# EAGLE board Cing_MainBoard (EAGLE 9.4.0), part 1 of 2
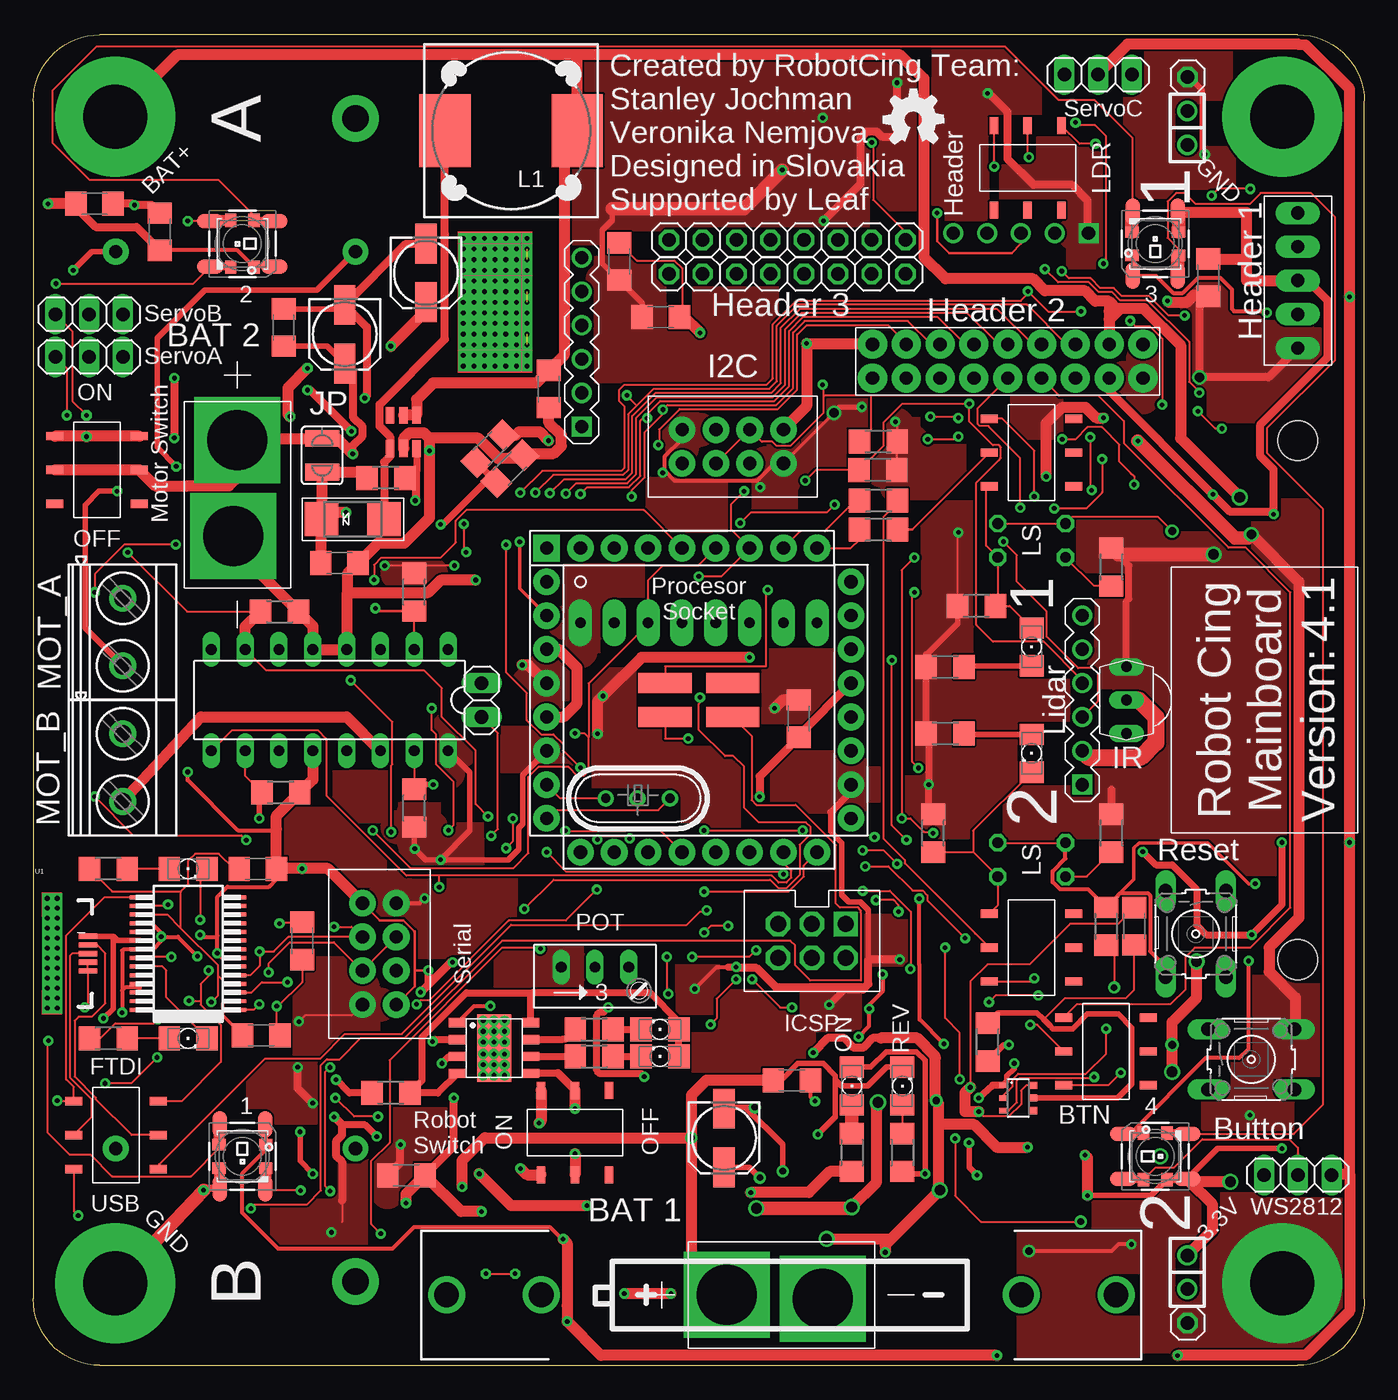
[diagram p7: board, top side]
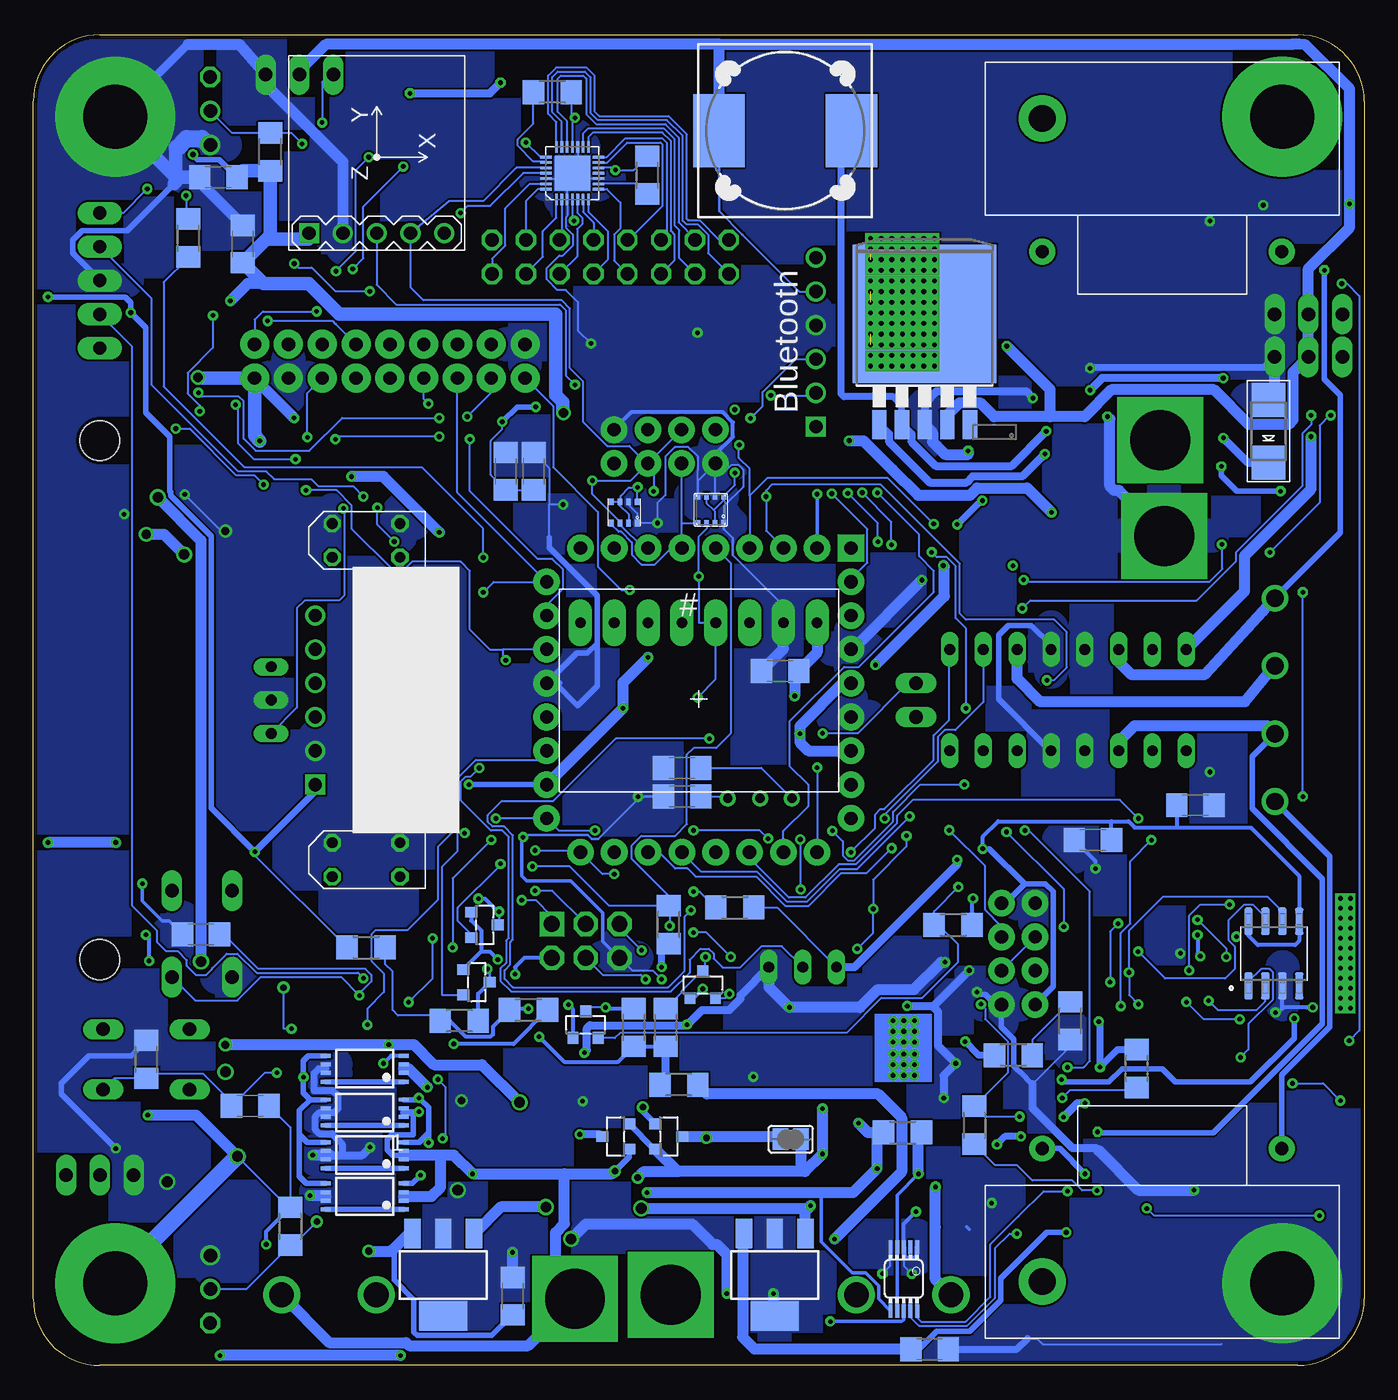
[diagram p8: board, bottom side, seen from below]

Size 100 x 100 mm. Coordinates in mm from the lower left corner, seen from the top.
Outline: 5,0 95,0 arc90 100,5 100,95 arc90 95,100 5,100 arc90 0,95 0,5 arc90 5,0
Copper layers (1*16): Top 0.035mm / dielectric 1.5mm / Bottom 0.035mm
Design rules "default *": minimum track width 6mil, minimum drill 0.35mm, track to track 6mil, track to pad 6mil, pad to pad 6mil, via to via 6mil, smd to smd 6mil, copper to edge 10mil, drill to drill 6mil, minimum pad ring 10mil, minimum via ring 8mil, stop-mask expansion 4mil, vias tented up to drill 0mil, thermal gap 10mil

## Footprints (pad centres in the part's own frame; a part is rotated, then mirrored left to right if it is on the bottom)
TSSOP-8 = smd 0.3 x 0.75: 1 -0.975,-2.925; 2 -0.325,-2.925; 3 0.325,-2.925; 4 0.975,-2.925; 5 0.975,2.925; 6 0.325,2.925; 7 -0.325,2.925; 8 -0.975,2.925
BATTERY-AA-KIT = drill 1.854: GND@1 25.146,0; GND@2 18.034,0; PWR@1 -25.146,0; PWR@2 -18.034,0
C1206 = smd 1.6 x 1.8: 1 -1.4,0; 2 1.4,0
153CLV-0505 = smd 3 x 1.6: + 2.2,0; - -2.2,0
SMADIODE = smd 2.54 x 2.54: A 2.349,0; C -2.349,0
L293 = drill 0.813 long: 1 -8.89,-3.81; 2 -6.35,-3.81; 3 -3.81,-3.81; 4 -1.27,-3.81; 5 1.27,-3.81; 6 3.81,-3.81; 7 6.35,-3.81; 8 8.89,-3.81; 9 8.89,3.81; 10 6.35,3.81; 11 3.81,3.81; 12 1.27,3.81; 13 -1.27,3.81; 14 -3.81,3.81; 15 -6.35,3.81; 16 -8.89,3.81
TO263-5 = smd 1.067 x 2.159: 1 -3.404,-5.791; 2 -1.702,-5.791; 3 0,-5.791; 4 1.702,-5.791; 5 3.404,-5.791 | smd 10.8 x 10.41: 6 0,2.54
FT232RL = smd 0.3 x 1.5: 1 -4.225,-3.625; 2 -3.575,-3.625; 3 -2.925,-3.625; 4 -2.275,-3.625; 5 -1.625,-3.625; 6 -0.975,-3.625; 7 -0.325,-3.625; 8 0.325,-3.625; 9 0.975,-3.625; 10 1.625,-3.625; 11 2.275,-3.625; 12 2.925,-3.625; 13 3.575,-3.625; 14 4.225,-3.625; 15 4.225,3.625; 16 3.575,3.625; 17 2.925,3.625; 18 2.275,3.625; 19 1.625,3.625; 20 0.975,3.625; 21 0.325,3.625; 22 -0.325,3.625; 23 -0.975,3.625; 24 -1.625,3.625; 25 -2.275,3.625; 26 -2.925,3.625; 27 -3.575,3.625; 28 -4.225,3.625
BMP280 = smd 0.35 x 0.5: 1 0.975,-0.8; 2 0.325,-0.8; 3 -0.325,-0.8; 4 -0.975,-0.8; 5 -0.975,0.8; 6 -0.325,0.8; 7 0.325,0.8; 8 0.975,0.8
BME280 = smd 0.35 x 0.5: 1 0.975,-1.025; 2 0.325,-1.025; 3 -0.325,-1.025; 4 -0.975,-1.025; 5 -0.975,1.025; 6 -0.325,1.025; 7 0.325,1.025; 8 0.975,1.025
1X01 = drill 1.016 octagon: 1 0,0
1X03 = drill 1.016 long: 1 -2.54,0; 2 0,0; 3 2.54,0
ICSP_HEADER = drill 1.2 pad 1.829 square: 1 -1.27,2.54 | drill 1.2 pad 1.829 octagon: 2 1.27,2.54; 3 -1.27,0; 4 1.27,0; 5 -1.27,-2.54; 6 1.27,-2.54
1X02 = drill 1.016 long: 1 -1.27,0; 2 1.27,0
DR125 = smd 3.85 x 5.5: 1 -4.975,0; 2 4.975,0
DR127 = smd 3.85 x 5.5: 1 -4.975,0; 2 4.975,0
1206 = smd 1.6 x 1.803: A -1.422,0; C 1.422,0
LED3535 = smd 1 x 0.85: 1 -1.75,0.875; 2 -1.75,-0.875; 3 1.75,-0.875; 4 1.75,0.875
WS2812B = smd 2 x 1.1: 1 -2.4,1.7; 2 -2.4,-1.7; 3 2.4,-1.7; 4 2.4,1.7
TCRT5000 = drill 0.8 octagon: A -2.54,1.27; C 2.54,1.27; E 2.54,-1.27; K -2.54,-1.27
MKDSN1,5/2-5,08 = drill 1.3 pad 2: 1 -2.561,0.025; 2 2.519,0.025
RJ9W = drill 0.813 long: A 2.54,0.635; E -2.54,0.635; S 0,0.635
HC49U = drill 0.7 pad 1.2: 1 -2.413,0; 2 -0.027,0; 3 2.413,0
SOT23 = smd 0.8 x 0.9: 1 -0.95,-1; 2 0.95,-1; 3 0,1
R1206 = smd 1.6 x 1.803: 1 -1.422,0; 2 1.422,0
LDR_OFFBOARD = drill 1.016: 1 -1.27,0; 2 1.27,0
B3F-10XX = drill 1.016 long: 1 -3.251,2.261; 2 3.251,2.261; 3 -3.251,-2.261; 4 3.251,-2.261
SJW = smd 1.27 x 2.54: 1 -1.27,0; 2 1.27,0
SJ = smd 1.168 x 1.6: 1 -0.762,0; 2 0.762,0
USB_SWITCH = smd 1.27 x 0.635: CH1A -3.175,2.54; CH1B -3.175,-2.54; CH2A 3.175,2.54; CH2B 3.175,-2.54; COM1 -3.175,0; COM2 3.175,0
TP4056 = smd 1.3 x 0.7: 1 -2.75,1.905; 2 -2.75,0.635; 3 -2.75,-0.635; 4 -2.75,-1.905; 5 2.75,-1.905; 6 2.75,-0.635; 7 2.75,0.635; 8 2.75,1.905 | smd 2.54 x 5.08: RADIATOR 0,0
TSOP18XX = drill 0.813 long: GND -0.001,-0.027; OUT -2.501,-0.027; VCC 2.499,-0.027
USB-MICRO-SMD = smd 1.4 x 0.4: D+1 2.7,0; D-1 2.7,0.65; GND1 2.7,-1.3; ID1 2.7,-0.65; VBUS1 2.7,1.3
QFN-28 = smd 0.85 x 0.2: 1 -1.975,1.2; 2 -1.975,0.8; 3 -1.975,0.4; 4 -1.975,0; 5 -1.975,-0.4; 6 -1.975,-0.8; 7 -1.975,-1.2; 15 1.975,-1.2; 16 1.975,-0.8; 17 1.975,-0.4; 18 1.975,0; 19 1.975,0.4; 20 1.975,0.8; 21 1.975,1.2 | smd 0.2 x 0.85: 8 -1.2,-1.975; 9 -0.8,-1.975; 10 -0.4,-1.975; 11 0,-1.975; 12 0.4,-1.975; 13 0.8,-1.975; 14 1.2,-1.975; 22 1.2,1.975; 23 0.8,1.975; 24 0.4,1.975; 25 0,1.975; 26 -0.4,1.975; 27 -0.8,1.975; 28 -1.2,1.975 | smd 2.65 x 2.65: 29 0,0
MPU-6050 = drill 0.8 pad 1.778 long: ADO 0,-6.35; GND 0,6.35; INT 0,-8.89; SCL 0,3.81; SDA 0,1.27; VCC 0,8.89; XCL 0,-3.81; XDA 0,-1.27
SOIC-8N = smd 0.65 x 2.07: 1 -1.905,-2.425; 2 -0.635,-2.425; 3 0.635,-2.425; 4 1.905,-2.425; 5 1.905,2.425; 6 0.635,2.425; 7 -0.635,2.425; 8 -1.905,2.425
PROCESSOR-SOCKET_PCB = smd 4 x 1.5: 32 2.54,1.27; 36 -2.54,1.27; D+ 2.54,-1.27; D- -2.54,-1.27 | drill 1 pad 2: A0 11.43,6.35; A1 11.43,8.89; A2 8.89,11.43; A3 6.35,11.43; A4 3.81,11.43; A5 1.27,11.43; A6 11.43,-3.81; A7 11.43,3.81; AREF 11.43,-1.27; CRYST1 -11.43,-6.35; CRYST2 -11.43,-8.89; D0 -3.81,11.43; D1 -6.35,11.43; D2 -8.89,11.43; D3 -11.43,8.89; D4 -11.43,6.35; D5 -8.89,-11.43; D6 -6.35,-11.43; D7 -3.81,-11.43; D8 -1.27,-11.43; D9 1.27,-11.43; D10 3.81,-11.43; D11 6.35,-11.43; D12 8.89,-11.43; D13 11.43,-8.89; GND -11.43,3.81; GND2 -11.43,-1.27; GND3 11.43,1.27; RESET -1.27,11.43; VCC -11.43,1.27; VCC2 -11.43,-3.81; VCC3 11.43,-6.35 | drill 1 pad 2 square: P$1 -11.43,11.43
BIG_HEADER = drill 1 pad 2.184: +3V3 1.27,10.16; +5V -1.27,7.62; +5V1 1.27,-10.16; A0 1.27,-7.62; A1 1.27,-5.08; A4 1.27,-2.54; A5 1.27,0; A6 1.27,2.54; A7 1.27,5.08; D0 -1.27,-7.62; D1 -1.27,-5.08; D2 -1.27,-2.54; D3 -1.27,0; D4 -1.27,2.54; D5 -1.27,5.08; D6 -1.27,10.16; GND -1.27,-10.16; GND2 1.27,7.62
I2_HEADER = drill 1 pad 2: 5V 1.27,3.81; +5V -1.27,-3.81; GND1 -1.27,3.81; GND2 1.27,-3.81; SCL 1.27,-1.27; SCL2 -1.27,1.27; SDA 1.27,1.27; SDA2 -1.27,-1.27
SERIAL_HEADER = drill 1 pad 2: 5V 1.27,3.81; +5V -1.27,-3.81; GND -1.27,3.81; GND2 1.27,-3.81; RXD -1.27,-1.27; RXD2 1.27,1.27; TXD -1.27,1.27; TXD2 1.27,-1.27
SOT23-6 = smd 1.27 x 0.635: P$1 0,0; P$2 0,-1; P$3 0,-2; P$4 2.5,-2; P$5 2.5,-1; P$6 2.5,0
BATTERY_CONECTOR_D = drill 4.5 pad 6.452 square: + 4.1,0; - -3.1,0.3
SOT23-6' = smd 0.4 x 0.55: 1 -0.95,-1.15; 2 0,-1.15; 3 0.95,-1.15 | smd 0.55 x 0.55: 4 0.95,1.15; 5 0,1.15; 6 -0.95,1.15
POLULU_MOTOR = drill 1 pad 1.93: + -10,9; - -10,-9 | drill 2 pad 3.5: P$1 0,9; P$2 0,-9
CONNECTOR_1X5 = drill 1 pad 1.676 long: +5V 0,-5.08; A1 0,5.08; A2 0,2.54; A3 0,-2.54; GND 0,0
MSOP10_0.5 = smd 0.3 x 1.02: 1 -1,-2.4; 2 -0.5,-2.4; 3 0,-2.4; 4 0.5,-2.4; 5 1,-2.4; 6 1,2.4; 7 0.5,2.4; 8 0,2.4; 9 -0.5,2.4; 10 -1,2.4
RANGING-SENSOR-VL53L0X = drill 1 square: 1 -3.81,6.35 | drill 1: 2 -3.81,3.81; 3 -3.81,1.27; 4 -3.81,-1.27; 5 -3.81,-3.81; 6 -3.81,-6.35
COMPASS-HMC5883L = drill 1 square: 1 -5.715,5.08 | drill 1: 2 -5.715,2.54; 3 -5.715,0; 4 -5.715,-2.54; 5 -5.715,-5.08
LEGO-1X1 = drill 4.8 pad 9: LEGO 0,0
BALL = hole 3: 0,19.5; 0,-19.5
WIRELESS-BLUETOOTH-HC-05 = drill 1 square: 1 -6.35,0 | drill 1: 2 -3.81,0; 3 -1.27,0; 4 1.27,0; 5 3.81,0; 6 6.35,0
LM39100S-3.3 = smd 1.219 x 2.235: 1 -2.311,-3.099; 2 0,-3.099; 3 2.311,-3.099 | smd 3.6 x 2.2: TAB 0,3.099

## Placement (x,y rotation side)
1  FS8205  [TSSOP-8]  75.1,19 90 bottom
8205  FS8205  [TSSOP-8]  75.1,15.8 90 bottom
BT1  [BATTERY-AA-KIT]  56.2,5.3 0 top
C1  100n  [C1206]  56.98,21.43 0 top
C2  100n  [C1206]  16.87,37.32 0 top
C3  100n  [C1206]  17.12,24.8 0 top
C4  22uf  [C1206]  4.6,87.3 0 top
C5  100n  [C1206]  84.26,84.28 90 bottom
C6  100n  [C1206]  86.1,89.3 0 bottom
C7  22p  [C1206]  51.26,44.9 0 bottom
C8  22p  [C1206]  51.26,42.74 0 bottom
C9  100n  [C1206]  9.5,85.2 90 top
C10  100n  [C1206]  32.66,1.21 0 bottom
C11  100n  [C1206]  63.98,5.21 270 bottom
C12  100n  [C1206]  28.02,14.28 0 top
C13  100n  [C1206]  88.27,81.75 90 top
C14  22uf  [C1206]  23,60.3 0 top
C15  22uf  [C1206]  38.74,73.37 270 top
C16  100n  [C1206]  82.7,33 90 top
C17  47uf  [153CLV-0505]  29.5,82.1 270 top
C18  100n  [C1206]  20.2,31.9 90 top
C19  100n  [C1206]  47.14,78.79 0 top
C20  100n  [C1206]  44.01,82.96 90 top
C21  100n  [C1206]  43.9,52.2 0 bottom
C22  22uf  [C1206]  57.5,48.6 270 top
C23  47uf  [153CLV-0505]  23.4,77.5 270 top
C24  100n  [C1206]  18.8,78 90 top
C25  100n  [C1206]  87.4,32.4 0 bottom
C26  100n  [C1206]  83.7,19.5 0 bottom
C27  10uf  [153CLV-0505]  51.9,17.1 270 top
C28  100n  [C1206]  12.7,42.1 0 bottom
C29  100n  [C1206]  20.4,39.5 0 bottom
C30  100n  [C1206]  62.4,67.2 270 bottom
C31  100n  [C1206]  64.5,67.2 270 bottom
D1  [SMADIODE]  7.2,70.2 90 bottom
D3  [SMADIODE]  24,63.6 0 top
IC1  L293D  [L293]  22.27,50 180 top
IC2  LM2576S  [TO263-5]  33.04,76.5 0 bottom
IC3  FT232RL  [FT232RL]  11.63,30.95 90 top
IC4  BMP280  [BMP280]  55.6,64.1 0 bottom
IC5  BME280  [BME280]  49.1,64.3 0 bottom
JP1  [1X01]  57.91,82.03 0 top
JP2  ServoA  [1X03]  4.2,75.8 0 top
JP3  ServoB  [1X03]  4.2,79 0 top
JP4  ServoC  [1X03]  80,97 0 top
JP5  ICSP  [ICSP_HEADER]  58.5,31.9 270 top
JP6  [1X01]  57.91,84.58 0 top
JP7  [1X01]  60.45,82.03 0 top
JP8  [1X01]  62.99,82.03 0 top
JP9  [1X01]  60.45,84.58 0 top
JP10  [1X01]  62.99,84.58 0 top
JP11  [1X01]  65.53,82.03 0 top
JP12  [1X01]  47.75,84.58 0 top
JP13  [1X01]  47.75,82.03 0 top
JP14  [1X01]  50.29,84.58 0 top
JP15  [1X01]  52.83,82.03 0 top
JP16  [1X01]  52.83,84.58 0 top
JP17  [1X01]  55.37,84.58 0 top
JP18  [1X01]  55.37,82.03 0 top
JP19  [1X01]  50.29,82.03 0 top
JP20  [1X01]  65.53,84.58 0 top
JP21  [1X01]  86.71,3.18 0 top
JP22  [1X01]  86.71,96.82 0 top
JP23  [1X02]  33.69,50 90 top
L1  DR125  [DR125]  35.9,92.8 180 top
L2  DR127  [DR127]  43.5,92.8 180 bottom
LED1  Charging  [1206]  47.09,25.25 180 top
LED3  RXD  [1206]  11.63,37.32 0 top
LED4  WS2812B3535  [LED3535]  84.29,84.29 0 top
LED5  WS2812B  [WS2812B]  15.71,15.71 270 top
LED6  WS2812B  [WS2812B]  15.71,84.29 180 top
LED7  WS2812B  [WS2812B]  84.29,84.29 90 top
LED8  WS2812B  [WS2812B]  84.29,15.71 0 top
LED9  WS2812B3535  [LED3535]  15.71,84.29 90 top
LED10  WS2812B3535  [LED3535]  15.71,15.71 180 top
LED11  WS2812B3535  [LED3535]  84.29,15.71 270 top
LS1  1  [TCRT5000]  75,62 180 top
LS2  2  [TCRT5000]  75,38 180 top
MOT_A  MKDSN1,5/2-5,08  [MKDSN1,5/2-5,08]  6.7,55.1 270 top
MOT_B  MKDSN1,5/2-5,08  [MKDSN1,5/2-5,08]  6.7,44.9 270 top
ON  GREEN  [1206]  61.5,21 90 top
POT  100k  [RJ9W]  42.2,29.3 0 top
Q1  16mhz  [HC49U]  45.42,42.61 0 top
Q2  BSS138  [SOT23]  58.5,25.6 0 bottom
Q3  BSS138  [SOT23]  49.7,28.6 0 bottom
Q4  BSS138  [SOT23]  66.1,33.1 270 bottom
Q5  BSS138  [SOT23]  66.7,28.8 270 bottom
Q6  NP2301AMR-G  [SOT23]  56.24,17.2 90 bottom
Q7  NP2301AMR-G  [SOT23]  52.26,17.2 270 bottom
R1  10k  [R1206]  52.27,33.12 270 bottom
R2  10k  [R1206]  91.5,23 270 bottom
R3  40  [R1206]  26.87,20.48 0 top
R4  1k  [R1206]  26.37,23.31 0 bottom
R5  10k  [R1206]  42.13,25.25 180 top
R6  R100  [R1206]  65.3,16 90 top
R7  10k  [R1206]  29.3,18.05 90 bottom
R8  1k  [R1206]  22.1,25.9 270 bottom
R9  10k  [R1206]  34.3,68.9 225 top
R10  4k7  [R1206]  68.5,52.5 180 top
R11  10k  [R1206]  42.13,23.22 180 top
R12  10k  [R1206]  18.6,43.05 0 top
R13  10k  [R1206]  28.61,41.88 270 top
R14  10k  [R1206]  28.61,58.11 270 top
R15  10k  [R1206]  18.5,56.65 180 top
R16  100  [R1206]  81,40 270 top
R17  10k  [R1206]  67.6,40 270 top
R18  100  [R1206]  81,60 270 top
R19  10k  [R1206]  70.86,57.07 0 top
R20  4k7  [R1206]  68.5,47.5 180 top
R21  PHOTOCELL1  [LDR_OFFBOARD]  86.7,7 270 top
R22  R100  [R1206]  61.5,16 90 top
R23  PHOTOCELL1  [LDR_OFFBOARD]  86.7,93 90 top
R24  100  [R1206]  5.63,37.32 0 top
R25  100  [R1206]  5.63,24.58 0 top
R26  40  [R1206]  88.37,84.73 90 bottom
R27  1k  [R1206]  63.5,62.8 0 top
R28  1k  [R1206]  63.5,65 180 top
R29  1k  [R1206]  82.2,91.2 270 bottom
R30  1k  [R1206]  63.48,69.42 0 top
R31  1k  [R1206]  63.45,67.29 0 top
R32  1k  [R1206]  80.69,10.46 90 bottom
R33  10k  [R1206]  54.9,25.4 90 bottom
R34  10k  [R1206]  30.9,33.1 180 bottom
R35  10k  [R1206]  52.5,25.4 90 bottom
R36  100  [R1206]  51.5,21.1 0 bottom
R37  10k  [R1206]  62.8,26.7 0 bottom
R38  10k  [R1206]  47.3,34.4 180 bottom
R39  10k  [R1206]  68,25.9 0 bottom
R40  10k  [R1206]  17.1,22.3 270 bottom
R41  2R  [R1206]  34.7,17.5 180 bottom
R42  10k  [R1206]  53.86,89.45 270 bottom
R43  10k  [R1206]  61,95.7 0 bottom
R44  100R  [R1206]  75,31.4 180 bottom
R46  1k  [R1206]  35.8,67.4 45 top
R47  1k  [R1206]  80.6,33 90 top
R48  100  [R1206]  71.7,24.3 270 top
R49  12K  [R1206]  26.5,66.7 0 top
REV  RED  [1206]  65.3,21 90 top
S2  Reset  [B3F-10XX]  87.33,32.43 270 top
S4  Button  [B3F-10XX]  91.5,23 0 top
SJ1  [SJW]  21.7,68.4 90 top
SJ2  [SJ]  43.1,17 0 bottom
SW1  [USB_SWITCH]  6.22,17.31 180 top
SW2  [USB_SWITCH]  75,31.4 0 top
SW3  [USB_SWITCH]  75,68.6 0 top
SW4  [USB_SWITCH]  80.6,23.6 0 top
SW5  [USB_SWITCH]  40.7,17.5 270 top
SW6  [USB_SWITCH]  4.8,67.3 0 top
SW7  [USB_SWITCH]  74.7,90 270 top
T1  FS8205  [TSSOP-8]  75.1,12.7 90 bottom
T2  FS8205  [TSSOP-8]  75.1,22.3 90 bottom
TP4056  TP4056  [TP4056]  34.63,23.86 0 top
TSOP4838  TSOP4838  [TSOP18XX]  82.1,50 90 top
TXD  TXD  [1206]  11.63,24.58 0 top
TXD1  LightSensor 1  [1206]  75,54 90 top
TXD2  LightSensor 2  [1206]  75,46 270 top
U1  [USB-MICRO-SMD]  1.4,30.95 0 top
U2  [QFN-28]  59.5,89.6 90 bottom
U3  MPU-6050MPU6050  [MPU-6050]  50,55.8 270 bottom
U4  CH330N  [SOIC-8N]  6.8,30.95 0 bottom
U$1  PROCESSOR-SOCKET_PCB  [PROCESSOR-SOCKET_PCB]  50,50 0 top
U$2  Header 2  [BIG_HEADER]  73.21,75.47 270 top
U$3  I2C_HEADER  [I2_HEADER]  52.56,69.05 270 top
U$4  SERIAL_HEADER  [SERIAL_HEADER]  26,30.93 180 top
U$5  MT3608SOT23-6  [SOT23-6]  26.8,68.9 90 top
U$6  BATTERY_CONECTOR_D  [BATTERY_CONECTOR_D]  15.33,65.43 90 top
U$7  BATTERY_CONECTOR_D  [BATTERY_CONECTOR_D]  56.2,5.3 180 top
U$8  DW01  [SOT23-6']  74,20.1 270 top
U$9  POLULU_MOTOR  [POLULU_MOTOR]  15.2,6.3 270 bottom
U$12  CONNECTOR_1X5  [CONNECTOR_1X5]  95,81.53 0 top
U$13  ADS1015IDGT  [MSOP10_0.5]  34.6,6.5 180 bottom
U$14  RANGING-SENSOR-VL53L0X  [RANGING-SENSOR-VL53L0X]  75,50 180 top
U$15  [COMPASS-HMC5883L]  74.2,90.8 90 bottom
U$16  BAT+  [LEGO-1X1]  6.16,93.84 0 top
U$17  3.3V  [LEGO-1X1]  93.84,6.16 0 top
U$18  GND  [LEGO-1X1]  6.16,6.16 0 top
U$19  GND  [LEGO-1X1]  93.84,93.84 0 top
U$20  BALL  [BALL]  95,50 0 top
U$22  OPENSOURCE  [OSHW_5MM]  66.12,93.62 0 top
U$23  WIRELESS-BLUETOOTH-HC-05  [WIRELESS-BLUETOOTH-HC-05]  41.2,76.9 90 top
U$24  POLULU_MOTOR  [POLULU_MOTOR]  15.2,93.7 90 bottom
U$25  LM39100S-3.3  [LM39100S-3.3]  44.3,6.8 180 bottom
U$26  LM39100S-3.3  [LM39100S-3.3]  69.2,6.8 180 bottom
VERSION  4.1  [VERSION]  99.5,50 90 top
WS2812  [1X03]  95,14.3 180 top
YELLOW  Full  [1206]  47.09,23.22 180 top

## Tracks (layer width: path | path; a pad name or v marks a point on that pad's centre or on a via)
36  (via drill 0.35)
  Top 0.152: v55.18,58.28 55.05,58.14 55.05,52.54 47.46,52.54 U$1.36
  Bottom 0.152: U$2.+5V1 60.94,72.09 60.94,67.5 57.58,64.13 57.58,60.03 55.83,58.28 v55.18,58.28
+3V3  (via drill 0.35, 0.4, 0.55, 0.7, 0.8)
  Top 0.152: U$4.5V 23.93,26.32 20.44,26.32 v19.96,25.84 | v31.64,60.11 29.19,60.11 R14.1 28.04,60.1 v26.4,60.1 | v47.29,67.08 47.45,67.24 | 23.2,12.4 23.2,10.78 | v54.6,66 54.6,66.25 54.37,66.48 | R19.1 69.44,62.54 v69.5,62.6
  Top 0.203: v64.77,70.92 64.91,70.78 R30.2 64.88,69.39 R31.2
  Top 0.254: v60.16,71.59 56.37,67.8 U$3.5V
  Top 0.305: v49.7,28.3 51.33,29.93 52.2,29.93 | U$4.+5V 29.04,34.74 v29.4,35.1 | U$3.5V 55.67,67.78 54.37,66.48 48.21,66.48 47.45,67.24 47.45,68.32 48.75,69.63 U$3.+5V | v74.8,8.6 81.01,8.6 81.51,9.1 v82.5,9.1
  Top 0.406: IC1.16 32.8,44.55 32.8,40.19 30.61,38 v30.6,38 | U$1.VCC2 36.76,44.38 36.76,40.7 36.46,40.4 36.46,38.77 35.69,38 v30.6,38 | v60.16,71.59 60.61,72.04 v62.25,72.04 | v88,91 87.82,91.18 87.82,95.83 86.83,96.82 JP22.1 | 59.9,41.57 59.9,40.11 60.73,39.28 60.73,35.37 61.27,34.83 62.14,34.83 62.73,34.24 62.73,30.5 | C19.1 45.74,79.83 C20.1 42.75,82.82 42.75,85.31 43.5,86.06 43.5,86.92 | R19.1 69.44,55.76 67.08,53.4 | v30.6,38 29.49,38 v28.66,38.82 28.61,38.87 R13.2
  Top 0.508: U$1.VCC3 61.43,43.1 59.9,41.57 | 52.2,29.93 v52.8,29.93 | 60.82,28.25 60.82,28.12 v59.8,27.1 | v25.8,17.2 24.93,18.07 23.2,18.07 | 67.08,53.4 R10.2 R20.2 67.28,47.29 67.28,44.58 67.27,44.56 v67.27,43.65 67.27,41.75 R17.1 | TSOP4838.VCC 82.13,57.43 82.31,57.61 82.31,60.11 R18.1
  Top 0.61: U$12.+5V 92.81,74.26 v87.62,74.26 87.62,79.7 C13.1 | v27.6,16.6 27.52,16.52 27.52,15.18 C12.1 | v65.1,30.5 62.73,30.5 62.73,28.66 62.47,28.4 | v52.8,29.93 52.87,29.86 54.34,29.86 55.8,28.4 62.47,28.4 | 60.82,28.25 62.32,28.25 62.47,28.4 | 81,43.28 R16.1 | v22.6,18.67 23.2,18.07 23.2,17.31 22.78,16.89 22.78,15.71 23.2,15.29 23.2,12.4 | 94.81,25.32 S4.2 | v64.9,96.4 64.9,92.34 63.73,92.34 63.34,92.73 62.65,92.73 62.16,92.25 62.16,88.8 v59.38,86.02 | U$15.1 79.22,84.65 79.22,87.55 78.05,88.72 75.15,88.72 73.2,90.66 73.2,94.2 71.75,95.65 v71.7,95.6 | v21,19.7 19.86,20.84 v19.86,22.41
  Top 0.813: U$1.VCC 37.2,52.64 v36.73,52.64 | v42.4,47.46 42.38,47.48 42.38,49.89 v42.8,50.3 45.7,53.21 v53.81,53.21 | R18.1 81.47,60.95 | C13.1 87.2,80.43 86.64,79.87 85.33,79.87 v85.2,80 | 94.81,25.32 94.81,27.63 92.84,29.61 92.84,31.39 95.09,33.64 95.09,58.88 v91.51,62.46 | C22.1 56.3,50 v55.69,49.39 | v80.4,71.2 79.86,71.2 79.04,72.02 77.31,72.02 76.1,70.81 v76.1,66.8
  Top 1.016: 81.47,60.95 v88.67,60.95 | v91.51,62.46 91.23,62.19 90.28,62.19 v82.99,69.48 | v56.27,89.83 53.42,86.92 43.5,86.92
  Bottom 0.152: v47.29,67.08 47.29,66.16 IC5.8 48.12,65.03 48.88,64.28 | IC5.2 48.77,64.17 48.88,64.28 | IC5.6 49.42,64.83 48.88,64.28 | U2.18 59.5,93.57 v59.3,93.76 59.58,94.03 R43.2 | v84.67,15.71 80.84,11.88 R32.2 80.69,17.89 C26.2 | U2.4 59.5,86.14 v59.38,86.02 | 82.51,84.63 82.2,84.94 | IC4.8 54.62,65.97 | 54.62,65.97 v54.6,66 | IC4.6 55.92,64.62 55.27,63.98 IC4.2 | IC4.6 IC4.5 | IC4.6 55.88,64.95 55.88,65.34 55.25,65.97 54.62,65.97 | C30.2 C31.2 65.63,66.93 65.63,69.5 64.77,70.35 v64.77,70.92 | R38.1 44.12,34.4 POT.E | R42.1 54.9,89.83 v56.27,89.83 56.43,90 U2.12
  Bottom 0.305: v49.7,28.3 50.4,27.6 Q3.1 | v29.4,35.1 29.48,35.02 R34.1 | Q4.1 67.1,33.43 66.34,32.68 66.34,31.11 | 66.34,31.11 Q5.1 | 66.34,31.11 65.7,31.11 v65.1,30.5 | Q2.1 59.45,26.75 v59.8,27.1 | v82.5,9.1 82.5,10.07 R32.2 | U4.8 8.7,32.3 8,31.6 5.2,31.6 4.9,31.91 U4.5 4.9,36.8 8.53,40.43 14.1,40.43 | v28.66,38.82 28.66,39.74 27.52,40.88 19,40.88 | 19,40.88 17.72,40.88 17.26,40.43 14.1,40.43 | C28.1 14.1,40.43 | C29.2 19,40.88
  Bottom 0.406: U$4.5V 24.73,27.14 23.37,28.5 23.37,35.6 23.97,36.2 25.49,36.2 25.51,36.17 | U$4.+5V 26.95,34.74 25.51,36.17 | 25.51,36.17 28.16,38.82 v28.66,38.82 | v67.27,43.65 U$1.VCC3 | v64.77,70.92 63.65,72.04 v62.25,72.04 | v88,91 88,90.95 87.66,90.61 86.01,90.61 C6.2 | 73,8.59 73,8.69 72.9,8.59 72.9,6.44 71.4,4.94 71.4,2.5 71.15,2.24 65.54,2.24 C11.2 | C10.1 33.46,1.21 32.13,2.55 29.66,2.55 27.33,4.88 27.33,6.55 23.88,10 v22.4,10
  Bottom 0.508: v52.8,29.93 52.8,31.16 R1.2 | v19.96,25.84 19.86,25.74 v19.86,22.41 18.55,23.72 R40.1 | v25.8,17.2 27,17.2 v27.6,16.6
  Bottom 0.61: v64.9,96.4 65.7,95.6 v71.7,95.6 | v21,19.7 21.57,19.7 v22.6,18.67 | POT.E 38.3,29.93 30.6,37.63 v30.6,38
  Bottom 0.813: v91.51,62.46 90.18,62.46 v88.67,60.95 | v36.73,52.64 31.55,57.82 31.55,60.03 v31.64,60.11 | U$1.VCC 39.17,51.27 42.41,48.03 42.41,47.53 42.4,47.52 v42.4,47.46 v42.41,47.45 42.41,46.82 41.78,46.19 U$1.VCC2 | U$1.VCC3 v55.69,49.39 55.69,51.33 v53.81,53.21 | C10.1 45.8,1.21 46.71,2.12 46.71,9.8 U$25.3 | 73,8.69 71.79,9.9 U$26.3 | 73,8.59 74.79,8.59 v74.8,8.6 | 82.68,81.3 83.9,81.3 v85.2,80 | v84.67,15.71 87.76,18.8 v91.4,18.8 | U3.VCC 41.11,53.59 C21.2 42.8,51.91 v42.8,50.3 | v69.5,62.6 73.7,66.8 v76.1,66.8 | v80.4,71.2 83.37,74.17 U$2.+3V3
  Bottom 1.016: v60.16,71.59 60.2,71.64 60.2,72.4 60.73,72.92 60.73,79 77,79 79.3,81.3 82.68,81.3 C5.1 82.51,84.63 79.33,84.63 U$15.1 | v87.62,74.26 87.56,74.2 U$2.+3V3 83.37,69.86 v82.99,69.48 | 82.2,84.94 R29.2 84.22,89.78 C6.2
  Bottom 1.27: U$17.LEGO 93.84,6.54 v84.67,15.71
  pour Top: -5.88,107.15 107.15,107.15 107.15,-3.34 -7.15,-3.34 -7.15,105.88
+5V  (via drill 0.35)
  Top 0.305: v63.81,29.4 63.81,28.11 62.8,27.1 v62.8,26.8 62.8,25.5 v62,24.7
  Bottom 0.152: R44.1 73.58,30.18 73,29.6 73,26.7 72.6,26.3 69.82,26.3 R39.1
  Bottom 0.305: JP5.2 63.11,30.63 63.81,29.93 v63.81,29.4 | R39.1 68.71,25.9 67.5,24.69 65.65,24.69 65.47,24.87 65.47,25.45 R37.1 64.12,26.8 v62.8,26.8 | R35.1 R33.1 56.06,22.82 60.12,22.82 v62,24.7
  Bottom 0.61: R36.1 52.5,21.52 R35.1
A0  (via drill 0.35)
  Top 0.152: v67.2,69.6 69.3,69.6 v69.5,69.8 | v77.3,69.6 78.3,69.6 79.2,70.5 80.3,70.5 81.6,69.2 81.6,67.92 82.41,67.11 82.7,66.82 v82.7,66.2 | v89.3,70.4 88.8,70.4 v87.49,71.71 | v86.5,78.9 85.31,78.9 83.83,80.38 81.76,80.38 81.17,80.97 80.16,80.97 79.43,81.7 77.8,81.7 v77.26,82.24 | v74.8,90.8 74.7,90.9 SW7.COM1
  Bottom 0.152: U$1.A0 61.43,57.15 60.2,58.38 60.2,59.8 61,60.6 62.1,60.6 67.2,65.7 v67.2,69.6 | v69.5,69.8 77.1,69.8 v77.3,69.6 | v89.3,70.4 88.26,70.4 84.74,66.88 83.38,66.88 v82.7,66.2 | v86.5,78.9 86.5,76.48 88.4,74.58 88.4,73.04 87.49,72.13 v87.49,71.71 | v77.26,82.24 75.76,83.74 75.76,89.84 v74.8,90.8
A0H  (via drill 0.35)
  Top 0.152: v67.4,71.3 69.4,71.3 v69.5,71.2 | v87.6,73.1 87.6,73.17 86.84,73.93 86.84,76.94 83.7,80.07 81.64,80.07 81.05,80.66 80.04,80.66 79.3,81.4 77,81.4 v76,82.4 | v72.2,90.1 72.2,93.13 SW7.CH1B
  Bottom 0.152: U$2.A0 65.59,73.11 v67.4,71.3 | v69.5,71.2 76.8,71.2 79.26,68.74 83.3,68.74 84.19,69.64 84.19,72.45 84.55,72.81 87.31,72.81 v87.6,73.1 | v76,82.4 75.2,83.2 75.2,87.1 v72.2,90.1
A1  (via drill 0.35)
  Top 0.152: v66.5,44.9 66.05,45.35 66.05,57.95 v66.2,58.1
  Bottom 0.152: U$2.A1 68.13,65.59 U$1.A1 65.41,58.89 v66.2,58.1 | v66.5,44.9 67.14,44.26 67.52,44.26 67.88,43.9 67.88,42.46 65.62,40.2 64.76,40.2 64.28,39.71 64.28,32.13 64.47,31.93 64.47,30.27 64.9,29.84 64.9,28.91 64.1,28.11 52.09,28.11 50.7,29.5 50.7,30.48 49.88,31.31 49.25,31.31 48.89,30.95 48.89,30.59 48.21,29.9 46.9,29.9 45.3,31.5 43.77,31.5 POT.S
A2
  Top 0.152: U$1.A2 61.43,61.43 62.08,62.08 R27.1
A3
  Top 0.152: U$1.A3 57.62,62.7 59.47,62.7 61.77,65 R28.2
A6  (via drill 0.35)
  Top 0.152: SW4.COM1 75.42,25.6 v74.9,25.6
  Bottom 0.152: U$1.A6 62.11,45.51 66.75,45.51 68.18,44.08 68.18,40.38 69.61,38.96 69.61,35 71.91,32.7 74.3,32.7 74.61,32.4 74.61,30.4 73.65,29.45 73.65,28.05 74.9,26.8 v74.9,25.6
A7  (via drill 0.35, 0.5)
  Top 0.152: v79.51,65.77 79.41,65.87 v79.41,69.75 | v68.5,31.4 68.5,26.1 69.6,25 v69.6,21.5 | v65.6,39.5 64.51,40.59 v64.51,53 | v69.25,17.05 69.25,12.75 71.19,10.81 v78.69,10.81
  Bottom 0.152: v79.41,69.75 79.41,73.08 U$2.A7 | U$1.A7 64.7,53.81 | v65.6,39.5 68.5,36.6 v68.5,31.4 | v64.51,53 64.7,53.19 64.7,53.81 | v69.25,17.05 69.05,17.25 69.05,20.95 v69.6,21.5 | v78.69,10.81 80.46,9.04 R32.1 84,5.73 R21.2 | v79.51,65.77 77.21,65.77 76.09,64.65 76.09,62.9 73.04,59.85 72.09,59.85 71.54,60.4 67.9,60.4 67.2,59.7 67.2,55.3 65.71,53.81 64.7,53.81
ATMEGA_D+  (via drill 0.35)
  Top 0.152: U$1.D+ 53.96,47.31 53.96,42.49 54.32,42.13 57.27,42.13 60.3,39.1 60.3,34.7 60.6,34.4 61.96,34.4 62.18,34.18 62.18,34.02 62.2,34 62.2,28.93 58.37,28.93 57.24,30.06 57.24,31.55 56.87,31.92 35.23,31.92 27.91,24.6 24.6,24.6 23.01,23.01 22.05,23.01 21.61,22.57 21.61,13.16 20.53,12.08 16.64,12.08 v16.35,11.79 | v3.38,11.26 3.05,11.6 SW1.CH2A
  Bottom 0.152: v16.35,11.79 15.82,11.26 v3.38,11.26
ATMEGA_D-  (via drill 0.35)
  Top 0.152: v50.6,34.2 50.5,34.1 50.09,34.1 49.1,33.11 35.9,33.11 27.7,24.91 23.41,24.91 21.55,23.05 17.4,23.05 9.46,15.11 9.46,14.84 SW1.CH1A | U$1.D- 47.46,47.1 v49.21,47.1
  Bottom 0.152: v49.21,47.1 56.24,47.1 60.92,42.42 64.79,42.42 65.85,41.36 65.85,40.86 65.49,40.5 64.63,40.5 63.97,39.84 63.97,32 64.17,31.8 64.17,30.12 64.59,29.7 64.59,29.04 63.97,28.41 52.3,28.41 51.07,29.64 51.07,33.73 v50.6,34.2
BAT+  (via drill 0.35, 0.6, 0.8, 0.8 pad 1)
  Top 0.406: R48.2 72.92,24.1 v73.3,24.1
  Top 0.813: U$5.P$5 U$5.P$4 28.8,72.6 30.03,73.83 37.8,73.83 C15.1 39.89,75.92 39.89,91.81 L1.1 40.88,98.38 41,98.5 | v61.49,11.9 63.36,13.77 63.36,19.67 | 80.83,79.98 80.83,79.2 | 80.83,79.2 80.83,78.6 | 80.83,78.6 U$2.+5V | 80.83,79.98 81.37,79.44 | 81.67,79.44 83.44,79.44 86.19,76.68 86.19,69.69 v90.64,65.24 | 81.67,79.44 81.37,79.44 | v33.5,14.4 35.9,12 v41.6,12 | v85.56,22.06 v85.56,24.1 85.56,25.79 87.4,27.63 v87.4,30.35 | U$16.LEGO 10.83,98.5 41,98.5 | 41,98.5 65.1,98.5 66.9,96.7 66.9,83.3 68.54,81.66 75.11,81.66 76,80.77 79.02,80.77 79.8,79.98 80.83,79.98 | 81.37,79.44 81.07,79.44 80.83,79.2 | 80.83,78.6 81.67,79.44
  Top 1.016: v61.49,11.9 61.39,11.8 v54.33,11.8 | 63.36,19.67 v63.46,19.77
  Bottom 0.254: U$13.7 U$13.4 35.1,12.8 v33.5,14.4
  Bottom 0.813: v90.64,65.24 87.4,62 v87.4,30.35 | v54.33,11.8 41.8,11.8 v41.6,12 41.99,11.61 U$25.1 | v61.49,11.9 64.89,11.9 U$26.1 | v63.46,19.77 66.29,22.6 69.9,22.6 71.4,24.1 v73.3,24.1 v85.56,24.1 | R41.1 33.5,17.28 v33.5,14.4
BAT-  (via drill 0.35, 0.5)
  Top 0.152: C16.2 81.49,33.19 77.9,33.19 74.85,30.15 71.7,30.15 70.39,28.84 v70.39,20.9 | v71.03,19.07 71.38,18.72 73.3,18.72 74.2,19.62 74.2,20.66 74.6,21.05 U$8.6
  Top 0.406: R6.1 65.48,14.4 v67,14.4 67,22.93 66.35,23.58 64.07,23.58 62.91,22.42 ON.C | C27.- 52,19.4 53.5,19.4 | 53.5,19.4 v54.2,19.4 | 53.5,19.4 56.3,16.6 v56.3,14.6
  Top 0.813: v71.03,19.07 70,19.07 70,20.51 v70.39,20.9
  Bottom 0.305: 1.3 72.17,19 1.2 | T1.2 72.17,12.7 T1.3 | T2.3 72.17,22.3 T2.2 | 8205.3 72.17,15.8 8205.2 8205.3
  Bottom 0.406: v71.03,19.07 71.44,19.07 71.44,17.33 73.07,17.33 73.4,17 73.4,16.2 73,15.8 72.17,15.8 | v54.2,19.4 54.2,19.09 Q7.1 | v56.3,14.6 55.24,15.66 Q6.1
  Bottom 0.508: 72.17,19 71.1,19 v71.03,19.07
  Bottom 0.813: 69.4,15.8 68.4,15.8 v67,14.4 60.1,14.4 | 69.4,15.8 72.17,15.8 | 60.1,14.4 56.5,14.4 v56.3,14.6 | 72.17,12.7 70.1,12.7 69.4,13.4 69.4,15.8 | v70.39,20.9 71.79,22.3 72.17,22.3 | 60.1,14.4 60.1,10.64 60.76,9.98 60.76,6.46 U$7.- 62.82,1.48 71.77,1.48 72,1.72 77.76,1.72 BT1.GND@1
BUTTON  (via drill 0.35)
  Top 0.152: v81.7,22 80.76,21.06 SW4.CH1B
  Bottom 0.152: S4.4 93.91,21.58 R2.2 91.14,21.94 87.28,21.94 85.1,19.75 C26.1 82.6,22 v81.7,22
CUR-SENSE  (via drill 0.35)
  Top 0.813: v36.6,14.8 37.08,14.33 SW5.CH2B | SW5.CH1B 38.16,18.36 v38,18.2 | R22.1 59.85,14.58 58.27,13 v53.9,13
  Bottom 0.254: 40.8,13 40.8,9.3 38.47,6.97 37.47,6.97 36.5,5.99 36.5,5 U$13.6
  Bottom 0.813: v53.9,13 40.8,13 38.4,13 v36.6,14.8 36.6,17.02 R41.2 37.3,17.5 v38,18.2
D2  (via drill 0.35)
  Top 0.152: U$2.D2 70,76.74 67.95,78.79 57.82,78.79 56.78,77.75 56.78,73.58 55.68,72.48 47.09,72.48 45.96,71.34 | 45.96,71.34 45.6,70.99 45.6,66.85 44.75,66 41.63,66 v41.11,65.48 | v46.12,71.19 45.96,71.34
  Bottom 0.152: v46.12,71.19 45.21,72.09 45.21,73.15 42.73,75.63 U$23.3
  Bottom 0.254: v41.11,65.48 U$1.D2
D3  (via drill 0.35)
  Top 0.152: U$2.D3 72.54,76.74 70.19,79.09 57.7,79.09 56.48,77.87 56.48,73.71 55.55,72.78 46.86,72.78 45.3,71.22 45.3,66.97 44.63,66.31 40.8,66.31 v40.01,65.52
  Bottom 0.152: U$1.D3 38.57,59.11 37.34,60.34 37.34,62.85 v40.01,65.52
D4  (via drill 0.35)
  Top 0.152: v84.8,72.2 84.8,77.18 83.92,78.06 82.84,78.06 v82.4,78.5 | v80.3,68.1 80.3,65.6 79.1,64.4 v76.7,64.4 | U$2.D4 75.08,76.74 72.42,79.4 57.57,79.4 56.17,78 56.17,73.84 55.43,73.09 46.73,73.09 44.99,71.35 44.99,67.1 44.5,66.61 39.87,66.61 v38.81,65.55
  Top 0.254: U$1.D4 36.55,58.37 v36.55,61.9
  Bottom 0.152: v82.4,78.5 77.54,78.5 77.31,78.26 77.27,78.26 U$2.D4 | v84.8,72.2 84.62,72.03 84.62,69.3 83.42,68.1 v80.3,68.1 | v76.7,64.4 76.61,64.31 76.61,57.89 77,57.5 79.6,57.5 80.2,56.9 80.2,49.42 TSOP4838.OUT | v36.55,61.9 36.55,63.29 v38.81,65.55
D5  (via drill 0.35)
  Top 0.152: v41.11,44.92 39.8,46.23 39.8,46.7 39.08,47.42 38.14,47.42 37.08,48.48 37.08,50.52 35.52,52.08 v35.52,61.67 | U$2.D5 77.62,76.74 74.66,79.7 57.45,79.7 55.87,78.12 55.87,73.96 55.3,73.39 46.6,73.39 45.36,72.14 | v37.72,65.59 39.05,66.91 44.3,66.91 44.69,67.3 44.69,71.48 45.36,72.14 | 45.36,72.14 v44.6,72.9
  Bottom 0.152: v41.11,44.92 U$1.D5 | v35.52,61.67 35.52,63.39 v37.72,65.59 | v44.6,72.9 41.39,72.9 U$23.2
D6  (via drill 0.35)
  Top 0.152: v78.71,79.21 76.23,79.21 v74.72,80.72 74.72,80.53 74.2,80.01 57.32,80.01 55.56,78.25 55.56,74.16 55.1,73.7 44.38,73.7 43.99,73.31 43.99,72.5 44.38,72.11 44.38,67.43 44.17,67.22 38.23,67.22 v36.59,65.58 | v78.3,93.4 78.5,93.2 79.78,93.2 80.58,92.4 80.58,82.98 v80.39,82.79
  Bottom 0.152: U$1.D6 43.65,40.16 41.79,42.02 41.79,43.65 43.19,45.05 43.19,48.39 39.08,52.5 37.98,52.5 32.35,58.13 32.35,59.7 33.45,60.81 33.45,62.45 v36.59,65.58 | v78.71,79.21 82.76,79.21 83.37,78.6 U$2.D6 | v74.72,80.72 77.3,80.72 79.08,82.5 80.1,82.5 v80.39,82.79 | JP4.1 78.3,96.43 v78.3,93.4
D+  (via drill 0.35)
  Top 0.152: IC3.15 5.35,35.17 2.48,32.3 2.48,21.48 3.05,20.91 SW1.CH2B 2.99,19.9 v1.8,19.9 | v9.3,23.15 7.35,21.2 v5.4,21.2
  Bottom 0.152: v9.3,23.15 8.7,23.74 8.7,25.66 6.88,27.49 6.88,29.56 7.11,29.79 7.76,29.79 8.7,28.84 U4.1 | v5.4,21.2 3.1,21.2 v1.8,19.9
D-  (via drill 0.35)
  Top 0.152: v10.12,34.63 10.02,34.53 8.02,34.53 IC3.16 | SW1.CH1B 11.14,19.85 14.09,22.8 14.09,25.58 12.56,27.1 12.56,27.4 | v13.17,29.68 13.17,29.27 12.56,28.66 12.56,27.4 | v11.7,27.4 12.56,27.4
  Bottom 0.152: v13.17,29.68 13.17,33.8 12.34,34.63 v10.12,34.63 | v11.7,27.4 11,26.7 8.1,26.7 7.44,27.36 U4.2
GND  (via drill 0.35, 0.55, 0.6, 0.8)
  Top 0.152: LED5.3 13.87,13.17 v12.79,13.17 | v3.88,26.91 4.1,27.13 U1.GND1 U1.ID1 | v85.56,62.7 84.52,63.74 78.01,63.74 LS1.K LS1.E | v52.8,29.02 51.34,27.56 51.34,26.06 v50.89,25.61 | C2.2 18.27,36.52 17.73,35.98 17.7,35.98 | 77.54,39.1 LS2.K LS2.E | C19.2 48.74,78.99 48.74,82.44 48.16,83.03 45.34,83.03 C20.2 | LED6.3 v11.61,85.99 v11.6,86 | v34,6.9 v36.2,6.9 | v60.2,64.7 59.6,64.1 53.91,64.1 v53.11,63.3
  Top 0.2: 28.65,30.4 28.65,29.68 28.65,28.5 U$4.GND
  Top 0.203: 28.65,29.68 v29.68,29.68 | 28.65,30.4 28.65,32.63 28.62,32.63 27.79,33.45 26.02,33.45 U$4.GND2
  Top 0.254: v91.8,36.2 91.31,36.2 88.25,39.26 83.08,39.26 82.69,38.87 82.69,36.52 81.67,35.51
  Top 0.305: C1.2 58.38,20.2 v58.73,19.85 | S2.4 85.07,29.95 83.91,31.12 83.91,35.33 83.73,35.51 81.67,35.51 81.5,35.33 81.5,35.32 R47.2 79.25,35.77 77.14,35.77 76.58,36.33 76.58,37.13 77.54,38.09 77.54,39.1 | IC3.26 8.01,28.4 | 8.01,28.4 IC3.25 | 8.01,28.4 6.9,28.4 6.68,28.18 | 6.68,28.18 v6.68,26.52 | 6.68,28.18 6.68,31.15 6.8,31.27 IC3.21 9,31.27 9.61,31.89 v9.61,32.22 | v11.6,44.6 11.6,43.99 15.37,40.22 18.19,40.22 18.27,40.3 | IC3.18 8.9,33.23 9.61,32.51 v9.61,32.22 | v9.61,32.22 10.86,32.22 v12.33,30.75 | v12.53,32.35 12.66,32.22 13.74,32.22 13.82,32.3 | 13.82,32.3 v13.82,30.97 14.17,30.62 IC3.7 | 13.82,32.3 13.82,35.22 14.58,35.98 17.7,35.98 | 17.73,35.98 18.29,36.54 18.29,37.34 | TP4056.1 33.12,27 v34.34,27
  Top 0.406: LED8.3 88.98,16.3 v93.8,16.3 | LED11.4 83.97,12.77 v79.2,12.77 | C24.2 23.1,79.4 C23.-
  Top 0.508: v45.9,21.69 45.68,21.91 42.59,21.91 42.35,22.15 42.35,26.32 42.59,26.56 42.86,26.56 v43.2,26.9 | LED5.3 12.79,13.31 v12.79,13.17 | v30.7,22.7 31.22,23.22 TP4056.3
  Top 0.61: U$12.GND 95.77,81.53 97.26,80.03 97.26,75.79 92.18,70.7 92.18,68.33 93.18,67.33 v93.18,63.97 92.97,64.18 89.9,64.18 v88.62,65.46 80.83,73.25 U$2.GND2 | v31.5,30.3 31.35,30.3 v29.1,28.05 29.68,28.63 v29.68,29.68 | LED11.4 85.22,14.01 LED8.3 | v58.6,23.5 59.7,24.6 60.92,24.6 61.65,23.86 62.35,23.86 63.08,24.6 63.68,24.6 | C4.2 7.5,87.3 v7.6,87.2 8.9,87.2 C9.2 | U$1.GND3 57.5,47.34 C22.2 54.57,44.27 v54.57,42.74 | C17.- 28,84.3 C23.- 25.06,78.04 25.06,72.86 v24.9,72.7 | C12.2 31.6,16.46 v31.6,20.1
  Top 0.813: v89.94,13.8 86.9,13.8 | 86.9,13.8 88.61,12.09 88.61,10.18 R21.1 | 86.9,13.8 LED8.3 | U$1.GND2 39.84,48.73 40.86,49.75 40.86,52.41 39.46,53.81 U$1.GND | 23.6,58.1 23.6,53.87 IC1.4 IC1.5 21,55.56 R15.1 15.03,61.54 U$6.- | 23.6,58.1 29.69,58.1 30.6,59.02 v33.24,59.02 | v33.68,11.56 32.14,11.56 C12.2 28,12.86 v28,12.2 | C13.2 90.85,83.15 91.15,82.98 | U$12.GND 91.15,81.53 91.15,82.98 | 91.15,82.98 91.15,86.64 86.04,86.64 | LED10.4 13.96,13.3 LED5.3 | 23.6,58.1 23.6,59.5 C14.2 25.87,61.77 27.85,61.77 29.77,63.69 v29.77,68.73 29.77,69.68 | 29.77,69.68 29.35,70.09 28.25,70.09 27.84,69.68 27.84,68.94 U$5.P$2 | U$2.GND 58.16,76.74 v58.1,76.8 58.1,72.08 56.37,70.35 U$3.GND1 | v59.6,9.5 64.44,9.5 | 64.44,9.5 v68.11,13.17 68.01,13.27 68.01,18.1 | LED9.4 13.36,86.04 LED6.3 | U$4.GND2 22.13,37.34 v20.2,37.34 18.29,37.34 C2.2 18.27,40.3 18.27,41.3 R12.2 21,44.03 IC1.12 | v19.3,71.3 19.12,71.48 19.12,73.45 v20.6,74.94 | 29.77,69.68 33.43,69.68 34.97,68.14 36.61,68.14 36.67,68.21 36.67,68.27 R46.2 36.94,68.53 39.1,68.53 39.66,69.1 39.66,69.9 38.74,70.82 C15.2 | v47.9,5.4 v44.4,5.4 | v79,15.8 79.2,15.6 v79.2,12.77 | v74.7,16.4 72.38,16.4 70.67,18.1 68.01,18.1 | 63.68,24.6 66.4,24.6 67.76,23.24 67.76,23.12 67.78,23.1 67.78,19.95 | 68.01,18.1 68.01,19.66 67.78,19.89 67.78,19.95 | v67.83,19.89 67.78,19.95 | 64.44,9.5 64,9.06 v64,8.5 | v50.1,77.6 48.91,78.79 C19.2
  Top 1.016: LED4.4 86.04,86.64 LED7.3 | v12.79,13.17 U$18.LEGO
  Top 1.27: U$14.2 79.31,45.69 83.2,45.69 84.31,46.8 84.35,46.8 84.35,48.7 83.05,50 TSOP4838.GND
  Bottom 0.152: U$3.GND2 50.08,66.46 IC5.5 50.08,67.26 50.06,67.27 50.06,68.29 50.78,69.01 51.8,69.01 52.52,68.29 52.52,65.41 53.11,64.81 v53.11,63.31 v53.11,63.3 IC4.1 54.62,64.03 55.27,64.67 IC4.7 | v88.62,65.46 85.86,62.7 v85.56,62.7 | C8.1 52.7,42.74 v54.57,42.74 | 24.95,21.14 22.1,23.99 R8.2 | IC5.7 48.77,67.76 U$3.GND2 | U$3.GND2 48.12,67.16 48.07,67.16 47.54,67.69 47.03,67.69 46.68,67.33 46.68,66.02 48.12,64.58 IC5.1 | 25.3,2.01 24.57,2.01 24.15,1.59 10.74,1.59 | v58.1,76.8 59.08,77.78 59.08,79.91 59.98,80.81 60.63,80.81 61.44,81.62 61.44,82.44 60.47,83.41 60.21,83.41 59.46,84.16 59.46,84.98 59.99,85.51 59.98,85.52 59.98,86.27 59.9,86.36 U2.3 59.9,89.2 | U$13.3 34.6,7.5 v34,6.9 | v36.2,6.9 35.6,7.5 U$13.5 | U2.17 59.1,90 U2.29 59.55,89.55 | 59.9,89.2 59.55,89.55 | U2.10 59.2,89.2 59.55,89.55 | U2.26 59.9,89.2 | C30.1 61.25,67.45 61.25,64.7 | 61.25,62.2 61.25,64.7 | v60.2,64.7 61.25,64.7 | JP5.6 55,29.67 53.45,29.67 v52.8,29.02
  Bottom 0.2: 44.82,58.28 43.65,57.12 U3.GND
  Bottom 0.203: v63.2,39.7 63.04,39.86 58.35,39.86 58.06,39.57 57.54,39.57 54.37,42.74 52.7,42.74 | IC5.1 48.12,62.86 47.44,62.18 47.44,60.91 44.82,58.28 | 53.1,10.63 56.17,10.63 56.4,10.4
  Bottom 0.254: JP5.6 57.2,31.87 57.2,34 59.61,36.41 62.91,36.41 63.3,36.8 63.3,39.6 v63.2,39.7 | 29.88,10.42 29.67,10.21 | C25.1 89.8,33.4 90.3,33.4 91.8,34.9 v91.8,36.2
  Bottom 0.305: U$3.GND2 48.75,68.48 47.45,69.78 47.45,70.86 48.21,71.63 55.06,71.63 U$3.GND1 | 58.86,19.72 v58.73,19.85 | v33.68,11.56 34.6,10.65 U$13.3 34.55,8.85 34.55,8.26 34.38,8.09 33.82,8.09 33.64,8.26 33.64,8.85 U$13.1 | 8205.7 78.03,15.8 8205.6 | 1.6 78.03,19 1.7 | T1.7 78.03,12.7 T1.6 | T2.6 78.03,22.3 T2.7 | v3.88,26.91 4.27,26.91 4.29,26.89 6.1,26.89 6.16,26.82 | v6.68,26.52 6.47,26.52 6.16,26.82 | 6.16,26.82 U4.3 | C29.1 20.2,37.9 v20.2,37.34 | v12.33,30.75 12.53,30.95 v12.53,32.35
  Bottom 0.406: 50.5,10.63 53.1,10.63 | 60.46,51.27 60.8,51.27 | 60.8,51.27 U$1.GND3 59.17,53.53 58.37,53.53 57.64,54.26 | R2.1 92.64,23.28 95.82,23.28 97.9,21.2 97.9,20.4 v93.8,16.3 | U$12.GND 95,81.54 97.03,83.58 97.03,84.56 96.33,85.26 92.95,85.26 89.4,88.81 | IC1.13 23.6,46.19 27.48,50.06 27.48,54.89 26.75,55.61 25.02,55.61 23.54,54.13 IC1.4 | v29.1,28.05 28.93,27.87 28.5,27.87 27.74,27.12 U$4.GND 27.27,25.42 26.33,24.48 26.33,22.49 26.3,22.49 26.1,22.29 26.1,22.26 25.89,22.05 25.86,22.05 24.95,21.14 | 61.25,62.2 61.25,61.46 57.64,57.86 57.64,54.26 | 57.64,54.26 57.64,51.05 59.1,49.6 59.13,49.6 60.8,51.27
  Bottom 0.508: C10.2 26.1,1.21 25.3,2.01 | 76.8,15.8 76.8,16.65 77.57,17.41 78.52,17.41 78.81,17.71 78.81,18.7 78.51,19 78.03,19 77.4,19 77.1,19.3 77.1,20.25 77.48,20.63 78.9,20.63 78.9,21.96 78.56,22.3 78.03,22.3 | v20.6,74.94 20.5,75.03 7.51,75.03 JP2.3
  Bottom 0.61: v58.6,23.5 58.41,23.69 58.41,25.34 58.18,25.57 50.89,25.57 | U$19.LEGO 88.39,99.28 | v74.7,16.4 75.3,15.8 76.8,15.8 77.7,15.8 78.03,15.8 | 19.95,16.15 20.16,16.34 21.95,16.34 24.95,19.35 24.95,21.14 | POT.A 46.87,27.81 46.87,27.58 47.75,26.69 49.76,26.69 50.89,25.57 | v50.89,25.61 50.89,25.57 | v34.34,27 32.36,27 | v29.68,29.68 32.36,27 | 32.36,27 32.36,26.9 32.04,26.59 32.04,24.04 v30.7,22.7 31.6,21.79 v31.6,20.1 | IC2.3 33.04,72.3 32.13,73.21 25.41,73.21 v24.9,72.7
  Bottom 0.813: v33.24,59.02 38.44,53.81 U$1.GND | 19.95,16.15 16.98,13.17 v12.79,13.17 | C5.2 87.5,88.92 C6.1 | 88.39,99.28 84.52,99.28 JP4.3 82.54,96.25 76.74,90.45 U$15.2 | 63.98,6.79 C11.1 64,6.63 v64,8.5 | v59.6,9.5 58.47,10.63 50.5,10.63 48.95,9.09 48.64,9.09 47.9,8.34 v47.9,5.4 | D1.A 6.74,73.01 JP2.3 | v19.3,71.3 19.12,71.12 19.12,66.07 18.79,65.75 18.45,65.75 U$6.- | IC2.3 32.43,70.1 32.43,69.4 31.49,68.46 29.77,68.46 v29.77,68.73 | v44.4,5.4 44.4,3.8 U$25.TAB | v79.2,12.77 78.09,12.77 78.03,12.7 | 77.7,15.8 v79,15.8 | C21.1 43.65,53.85 U3.GND | v31.5,30.3 31.8,30.3 33.84,28.26 36.54,28.26 37.9,26.9 v43.2,26.9 44.74,28.44 POT.A
  Bottom 1.016: C6.1 89.3,89.3 | 89.3,89.3 U$19.LEGO | 89.3,89.3 89.3,88.91 89.4,88.81 | 89.3,89.3 89.3,91.38 89.19,91.49
  Bottom 1.27: 89.19,91.49 88.49,92.19 87.34,92.19 86.88,91.73 R23.1
  pour Bottom: -7.15,108.42 107.15,108.42 107.15,-3.34 -7.15,-3.34
HD_A6
  Top 0.152: SW4.CH1A 78.44,27.15 85.45,27.15 86.57,28.27 86.57,30.7 87.26,31.38 91.42,31.38 94.45,34.42 94.45,58.1 91.1,61.45 89.8,61.45 81.92,69.33 81.92,70.97 80.02,72.88 77.07,72.88 U$2.A6
IN_A1  (via drill 0.35)
  Top 0.152: IC1.2 R14.2 | v4,71.4 2.93,72.47 2.93,77.73 JP3.1 | v36.03,41.11 36.03,39.38 v35.52,38.87
  Top 0.203: R14.2 25.91,56.69 v25.7,56.9
  Bottom 0.152: U$1.D10 53.01,38.57 51.78,37.34 50.84,37.34 50.23,36.73 45.68,36.73 43.49,34.54 41.75,34.54 39.3,36.99 37.39,36.99 v35.52,38.87 | v4,71.4 4,70.7 4.63,70.06 4.63,66.12 9.63,61.12 9.63,60.47 12.6,57.5 25.1,57.5 v25.7,56.9 | IC1.2 28.62,49.84 30.73,47.74 31.53,47.74 32.05,47.22 32.05,45.38 36.03,41.4 v36.03,41.11
IN_A2  (via drill 0.35)
  Top 0.152: v7.1,61.1 11.55,56.65 R15.2 | 15.97,53.77 17.47,52.26 29.34,52.26 30.7,50.9 30.7,48.74 33.24,46.2 33.24,42.19 v34.16,41.27 | JP2.1 2.53,74.93 v2.53,71.4
  Top 0.406: 15.97,53.77 IC1.7
  Top 0.813: IC1.7 15.92,55.51 R15.2
  Bottom 0.152: U$1.D9 49.8,37.1 45.62,37.1 43.36,34.85 41.87,34.85 39.42,37.3 38.1,37.3 34.16,41.24 v34.16,41.27 | v2.53,71.4 2.6,71.4 3.37,70.64 3.37,64.84 v7.1,61.1
IN_B1  (via drill 0.35)
  Top 0.152: R13.1 IC1.15 | v39.97,40.17 44.52,40.17 44.55,40.2 47.1,40.2 U$1.D8
  Top 0.406: v30.05,43.65 28.96,43.65 R13.1
  Bottom 0.152: v39.97,40.17 39.18,39.38 39.18,38.32 38.82,37.96 38.32,37.96 35.42,40.86 35.42,40.88 35.4,40.9 35.4,41.6 33.35,43.65 v30.05,43.65
IN_B2  (via drill 0.35)
  Top 0.152: R12.1 15.92,44.31 IC1.10
  Top 0.406: R12.1 16.98,42.85 v16.98,41.11
  Bottom 0.152: U$1.D7 46.19,38.11 43.24,35.15 42,35.15 39.49,37.66 38.19,37.66 35.09,40.76 35.09,41.33 33.92,42.5 18.37,42.5 v16.98,41.11
IRFU  (via drill 0.35, 0.5)
  Top 0.406: C1.1 56.18,21.43 57.44,22.69 59.33,22.69 60.24,21.78 60.24,21.46 | v58.94,17.36 60.24,18.66 60.24,21.46 | REV.C 64.1,22.42 62.68,21 60.7,21 60.24,21.46
  Top 0.61: U$7.+ 49.4,8
  Top 0.813: v32.22,13.42 32.22,15.4 33.93,17.11 49.42,17.11 v49.44,17.1 | C1.1 50.57,21.43 49.44,20.3 v49.44,17.1 | 49.4,8 49.44,8.03 v49.44,17.1
  Bottom 0.61: Q6.3 57.4,17.36 v58.94,17.36
  Bottom 0.813: BT1.PWR@1 32.22,6.47 32.22,10.4 v32.22,13.42 | Q7.3 49.5,17.2 | 49.5,17.2 44.06,17.2 SJ2.1 | 49.5,17.2 49.44,17.13 v49.44,17.1
MISO  (via drill 0.35)
  Top 0.152: v64.9,37.7 63.9,38.7 v62.3,38.7 | v38.57,38.57 40.02,37.12 56.15,37.12 v56.35,36.92 | U$1.D12 57.88,37.56 57.88,36.73 56.74,35.59 50.41,35.59 v50.4,35.6
  Bottom 0.152: Q4.2 67.1,32.4 68.1,33.4 68.1,34.4 65,37.5 65,37.6 v64.9,37.7 | v62.3,38.7 59.02,38.7 U$1.D12 57.24,36.92 v56.35,36.92 | v38.57,38.57 36.76,40.38 36.76,41.4 36.36,41.8 36.06,41.8 32.35,45.51 32.35,47.34 31.2,48.5 31.2,53.77 IC1.1 | R38.2 49.92,35.6 v50.4,35.6
MISO_HV  (via drill 0.35)
  Top 0.152: v63.3,34.96 64.64,34.96 65,34.6 v65,34.1
  Top 0.305: v68.41,24.16 66.58,25.99 66.58,30.08 66.56,30.1 v66.56,35.08
  Bottom 0.152: v63.3,34.96 62.26,34.96 61.04,33.74 JP5.1
  Bottom 0.203: v65,34.1 65,34 65,33.2 Q4.3
  Bottom 0.305: R37.2 63.91,24.16 v68.41,24.16 | v66.56,35.08 66.08,35.08 65,34
MOSI  (via drill 0.35)
  Top 0.152: U$1.D11 56.35,37.78 56.96,37.17 56.96,36.67 56.57,36.28 56,36.28 55.47,36.81 30.5,36.81 | IC1.9 14.93,47.74 21.37,47.74 22.02,47.09 22.02,42.83 28.03,36.81 30.5,36.81 | v30.5,35.94 30.5,36.81
  Bottom 0.152: Q2.2 56.3,24.6 55.9,25.01 38.89,25.01 36.28,27.62 33.22,27.62 30.52,30.32 30.52,31.62 32,33.1 R34.2 32.32,34.12 v30.5,35.94
MOSI_HV  (via drill 0.35)
  Top 0.152: v54,29.02 56.12,26.9 v57,26.9
  Bottom 0.152: v57,26.9 58.2,26.9 Q2.3 | JP5.4 57.23,29.36 54.35,29.36 v54,29.02
  Bottom 0.305: v57,26.9 56.92,26.82 R33.2
MOT_A+  (via drill 0.35)
  Top 0.406: U$24.+ 21.3,80.8 12.9,80.8 9.3,77.2 9.3,69 v10.74,67.56 | v6.3,65.7 4.93,65.7 3.89,64.66 3.89,55.42 MOT_A.2
  Bottom 0.406: v10.74,67.56 10.76,67.55 10.76,66.86 9.59,65.7 v6.3,65.7
  Bottom 0.813: MOT_A.2 8.98,49.87 24.34,49.87 26.08,51.61 IC1.3
MOT_A-  (via drill 0.35)
  Top 0.406: U$24.- 4.4,83.7 v3,82.3
  Bottom 0.406: v3,82.3 3,74.11 1.79,72.9 1.79,62.59 MOT_A.1
  Bottom 0.813: IC1.6 18.46,52.87 17.52,51.93 11.95,51.93 7.61,56.69 MOT_A.1
MOT_B+
  Top 0.813: MOT_B.2 12.62,48.73 23.54,48.73 IC1.14
  Bottom 0.406: U$9.+ 6.2,21.82 2.59,25.44 2.59,38.24 MOT_B.2
MOT_B-  (via drill 0.35)
  Top 0.406: v20.04,17.56 20.04,15.36 v21,14.4
  Bottom 0.406: v20.04,17.56 20.13,17.47 11.35,17.47 3.15,25.67 3.15,36.58 8.44,41.87 8.44,45.75 MOT_B.1 | v21,14.4 22.9,16.3 U$9.-
  Bottom 0.813: IC1.11 18.46,46.89 17.28,48.07 7.33,48.07 MOT_B.1
N$1  (via drill 0.35)
  Top 0.152: LED6.4 12.02,81.3 v1.7,81.3 | v1.14,24.4 1.14,24.1 1.08,24.04 1.08,17.49 2.74,15.84 4.3,15.84 5.91,14.22 11.85,14.22 13.96,16.33 LED10.3
  Top 0.61: LED9.1 14.78,82.59 LED6.4
  Top 0.813: LED10.3 13.96,18.11 LED5.2
  Bottom 0.152: v1.7,81.3 1.3,81.3 0.37,80.37 0.37,25.17 v1.14,24.4
N$2
  Top 0.152: LED9.3 16.59,86.41 13.89,89.11 4.21,89.11 1.44,91.88 1.44,95.79 4.78,99.13 73,99.13 77.02,95.12 79.72,95.12 82.59,92.24 LED7.4
  Top 0.61: LED9.3 18.06,86.04 LED6.2
  Top 1.016: LED4.1 82.54,86.64 LED7.4
N$3
  Bottom 0.406: 1.8 1.1
N$4  (via drill 0.35)
  Top 0.813: SW6.CH2A 4.04,69.84 v4,69.8 3.96,69.84 SW6.CH1A
  Bottom 0.813: IC1.8 9,58.19 9,60.86 4,65.86 v4,69.8
N$5
  Top 0.152: REV.A R6.2
N$6
  Bottom 0.152: R8.1 24.95,24.47 R4.2
N$7
  Top 0.152: U$1.CRYST2 39.2,41.74 46.96,41.74 Q1.3
  Bottom 0.152: C8.2 47.96,42.74 Q1.3
N$8
  Top 0.152: U1.D-1 4.12,31.59 4.79,31.59 5.42,30.95 5.42,27.21 4.41,26.2 3.4,26.2 3.11,25.91 3.11,21.71 4.7,20.12 4.7,20 7.39,17.31 SW1.COM1
N$9
  Top 0.508: R5.1 LED1.C
N$10
  Top 0.152: SW2.COM1 70.76,32.46 65.51,37.72 65.51,37.95 63.89,39.56 63.89,63.8 64.92,64.83 R28.1
N$11
  Top 0.152: 85.99,83.37 85.99,83.97 85.21,84.75 85.21,87.46 85.85,88.1 86.5,88.1 87.33,87.28 91.38,87.28 92.2,88.1 96,88.1 97.79,86.31 97.79,75.56 92.71,70.48 92.71,68.55 96.9,64.36 96.9,19.6 94.7,17.4 94.69,17.41 LED8.4
  Top 0.254: 86.64,17.46 LED8.4
  Top 0.61: LED11.1 86.64,17.46
  Top 1.016: LED7.2 85.99,83.37 LED4.3
N$12  (via drill 0.35)
  Top 0.152: LED5.4 17.57,13.15 v20.08,13.15
  Top 0.813: LED10.1 17.46,13.31 LED5.4
  Bottom 0.152: v20.08,13.15 21.2,13.15 21.95,13.9 24.95,13.9 26.09,15.05 27.72,15.05 R7.1
N$13
  Top 0.152: U1.D+1 4.07,30.98 2.95,30.98 2.79,30.82 2.79,21.6 4.4,19.99 4.4,18.66 SW1.COM2
N$14
  Top 0.152: Q1.1 39.61,42.61 U$1.CRYST1
  Bottom 0.152: C7.2 45.29,44.9 Q1.1
N$15
  Top 0.406: R10.1 70,52.58 TXD1.A
N$16
  Top 0.508: R11.1 YELLOW.C
N$17
  Top 0.406: TXD2.A 70,47.42 R20.1
N$18
  Top 0.508: TP4056.6 R11.2
N$19
  Top 0.508: TP4056.7 39.71,24.49 39.74,24.53 39.99,24.53 R5.2
N$20
  Top 0.152: LS2.A 79.15,36.73 R16.2
N$21  (via drill 0.35)
  Top 0.61: v23.9,70.2 20.8,73.3 v20.6,73.3 | v10.6,74.2 v10.59,74.19 v10.59,69.7
  Bottom 0.508: L2.1 39.3,92.03 39.3,73 39.1,72.8 35.4,72.8 34.74,72.14 IC2.2
  Bottom 0.61: IC2.2 34.03,70 34.03,69.44 32.19,67.6 26.5,67.6 v23.9,70.2 | v20.6,73.3 19.7,74.2 v10.6,74.2 | D1.C 8.74,67.85 v10.59,69.7
N$22
  Top 0.152: R18.2 79.69,58.58 LS1.A
N$23
  Bottom 0.152: R42.2 54.63,88.8 U2.9
N$24
  Top 0.152: SW3.CH1B 71.58,65.81 71.58,61.61 LS1.C 72.46,57.25 R19.2 73.35,57.07 TXD1.C
N$25
  Top 0.508: YELLOW.A LED1.A 48.51,25.83 46.34,28 37.5,28 | TP4056.4 30.41,20.48 R3.2 29.2,21.39 29.2,24.66 32.54,28 37.5,28 | TP4056.8 37.38,27.88 37.5,28
N$26  (via drill 0.35, 0.5)
  Top 0.406: C27.+ 53.8,14.9 v54.59,14.11
  Top 0.508: 39.42,21.95 TP4056.5
  Top 0.61: SW5.COM1 39.42,21.95
  Top 0.813: v40.7,15.9 SW5.COM2 | v40.7,19.3 SW5.COM1
  Bottom 0.406: Q6.2 53.34,16.25
  Bottom 0.61: 53.34,16.25 Q7.2
  Bottom 0.813: Q7.2 51.58,14.57 | 42.03,14.57 51.58,14.57 | 51.58,14.57 54.13,14.57 v54.59,14.11 | SJ2.2 42.34,14.88 42.03,14.57 | 42.03,14.57 v40.7,15.9 v40.7,19.3
N$27  (via drill 0.35)
  Top 0.508: v30,24.34 30.15,24.49 TP4056.2
  Bottom 0.508: R4.1 28.97,23.31 v30,24.34
N$28
  Bottom 0.152: U2.23 61.55,90.47 62.42,90.47 63.6,91.65 63.6,92.15 62.42,93.33 R43.1
N$29
  Top 1.016: R22.2 ON.A
N$30
  Bottom 0.152: JP1.1 56.85,83.09 56.85,85.25 58.3,86.7 U2.7
N$31  (via drill 0.35)
  Top 0.152: v75.2,65.3 75.2,68.74 72.8,71.14 SW3.CH1A
  Bottom 0.152: U$12.A2 91.12,80.19 91.12,73.69 84.61,67.18 82.48,67.18 81.9,66.6 79.1,66.6 78.58,66.08 75.97,66.08 v75.2,65.3
N$32
  Top 0.152: LED3.A R24.2
N$33  (via drill 0.35)
  Top 0.152: LED3.C 12.53,36.8 v12.53,33.49 | v10.38,30.7 8.08,30.7 IC3.22
  Bottom 0.152: v12.53,33.49 10.38,31.33 v10.38,30.7
N$34
  Top 0.152: TXD.A 8.11,24.58 R25.2
N$35  (via drill 0.35)
  Top 0.508: U$5.P$3 28.8,67.17 28.33,66.7 R49.2 | R9.2 R46.1 33.96,66.39 30.77,63.2 v30.6,63.2
  Top 0.61: R49.2 28.12,66.5 28.72,67.1 28.72,65.02 v28.7,65
  Bottom 0.152: 28.75,65.05 v28.7,65
  Bottom 0.508: v30.6,63.2 28.75,65.05
N$36
  Top 0.254: IC3.2 15.24,27.35 14.39,27.35 14.23,27.19 14.23,26.3 C3.1
N$37
  Bottom 0.152: U2.6 58.7,86.67 57.91,85.88 JP6.1
N$38
  Bottom 0.152: JP7.1 59.14,83.34 59.14,85.4 58.77,85.77 58.77,86.27 59.1,86.6 U2.5
N$39  (via drill 0.35)
  Top 0.152: IC3.17 10.06,33.88 11.08,32.86 | 13.88,29.28 14.52,28.65 15.23,28.65 IC3.4 | 11.08,32.86 13.88,30.05 13.88,29.28 | 11.08,32.86 11.08,35.6 11.09,35.61 | R25.1 5.03,24.58 6.16,25.71 9.06,25.71 v9.36,26.01 | v13.37,27.31 13.88,27.82 13.88,29.28 | C2.1 15.08,37.32 13.95,38.45 12.16,38.45 11.66,37.94 11.66,36.18 11.09,35.61 | 11.09,35.61 5.92,35.61 R24.1
  Bottom 0.152: v9.36,26.01 12.07,26.01 v13.37,27.31
N$40  (via drill 0.35)
  Top 0.152: SW2.CH1B 74.96,28.86 v75.2,29.1
  Bottom 0.152: v75.2,29.1 75.6,29.5 83.23,29.5 84.66,30.93 85.48,30.93 86.57,29.84 86.57,29.8 87.06,29.32 87.75,29.32 88.46,30.04 88.46,30.44 89.16,31.14 90.04,31.14 90.71,31.81 90.71,32.69 92.57,34.55 92.57,76.56 U$12.A3
N$41
  Top 0.152: LED11.3 84.33,14.88 85.71,14.88 87.83,17 94.36,17 95.01,16.35 WS2812.2
  Top 0.61: LED8.2 83.37,14.01 LED11.3
N$42  (via drill 0.35)
  Top 0.152: v91.43,88.42 89.03,88.42 v88.52,87.91
  Bottom 0.152: U$12.A1 93.24,86.61 v91.43,88.42 | v88.52,87.91 88.52,86.3 R26.2
N$43
  Top 0.2: SW3.COM1 66.03,62.8 R27.2
N$44
  Top 0.61: D3.A 26.36,63.62 26.36,67.89 26.8,68.33 U$5.P$1 26.8,69.8 26.02,70.58 26.02,72.22 30.93,77.12 30.93,85 L1.2
N$45
  Top 0.152: 70.61,38.58 LS2.C 72.46,34.58 SW2.CH1A | R17.2 70.61,38.58 | TXD2.C 70.61,40.19 70.61,38.58
N$46  (via drill 0.35)
  Top 0.813: 21.7,63.65 D3.C 21.65,60.35 C14.1 | 21.7,63.65 SJ1.1 24.65,67.13 R49.1 | R9.1 36.24,69.91 36.5,70.17 38.03,70.17 v38.7,69.5 | v23.5,64.1 22.15,64.1 21.7,63.65
  Bottom 0.813: v38.7,69.5 37.64,69.5 35.47,67.34 35.46,67.34 33.52,65.4 29.62,65.4 29.09,65.94 25.34,65.94 v23.5,64.1
N$47
  Bottom 0.406: 8205.1 8205.8
N$48  (via drill 0.35)
  Top 0.406: v70.3,16.74 70.3,14.9 v70.9,14.3 | v73.7,22.7 73.7,22.3 73.15,21.75 73.15,21.35 U$8.1
  Top 0.508: U$8.1 72.08,21.05 v71.03,20.1
  Bottom 0.305: T2.4 73.12,23.27 v73.7,22.7
  Bottom 0.406: 8205.4 71,16.77 70.3,17.48 | 70.3,17.48 70.3,19.4 70.88,19.98 v71.03,20.1 71.15,19.98 1.4 | T1.4 71.53,13.67 v70.9,14.3 | 70.3,17.48 v70.3,16.74
N$49  (via drill 0.35)
  Top 0.152: v79.7,21.67 79.7,21.6 78.29,21.6 78.29,21.61 74.12,21.61 73.9,21.39 73.9,19.75 73.3,19.15 U$8.3
  Bottom 0.406: 8205.5 79.4,16.77 80,17.38 | 1.5 79.2,19.98 | 80,17.38 80,19.18 79.2,19.98 | 80,17.38 80,14.2 79.47,13.67 T1.5 | 79.2,19.98 79.7,20.48 v79.7,21.67 79.7,22.9 79.33,23.27 T2.5
N$50
  Top 0.152: 75.9,26 77.51,27.61 82.1,27.61 82.7,28.21 C16.1
  Top 0.406: R48.1 72.48,26.5 75.4,26.5 75.9,26 76.2,25.7 76.4,25.5 76.6,25.3 78.1,25.3 79.2,26.4 81.5,26.4 82.53,25.36 82.53,21.16 81.47,20.1 U$8.5
N$51
  Bottom 0.152: JP8.1 61.71,83.31 61.71,85.24 60.7,86.25 U2.1
N$52
  Bottom 0.152: U2.2 60.3,84.72 JP9.1
N$53
  Bottom 0.152: U2.28 62.1,88.4 62.99,87.51 JP10.1
N$54  (via drill 0.35, 0.5)
  Top 0.152: R47.1 81.2,31.58 v81.2,28.4 | v80.6,25.3 80.6,23.43 79.09,21.91 73.99,21.91 73.58,21.5 73.58,20.98 72.85,20.25 U$8.2
  Bottom 0.152: v80.6,25.3 81.2,25.3 v81.2,28.4
N$55
  Bottom 0.152: JP11.1 65.53,83.17 64.54,84.16 64.54,86.96 62.7,88.8 U2.27
N$56
  Bottom 0.152: JP12.1 48.46,84.58 49.94,86.06 50.81,86.06 50.9,86.15 50.9,92.53 52.27,93.89 57.47,93.89 57.84,94.27 57.84,96.95 58.43,97.54 60.73,97.54 61.33,96.94 61.33,94.06 60.7,93.44 U2.21
N$57
  Bottom 0.152: JP13.1 49.3,83.58 49.3,84.98 50.06,85.74 50.92,85.74 51.21,86.03 51.21,92.4 52.39,93.59 57.6,93.59 58.15,94.14 58.15,96.83 58.56,97.23 60.6,97.23 61.02,96.82 61.02,94.18 60.3,93.47 U2.20
N$58
  Bottom 0.152: JP14.1 50.29,84.68 51.51,85.9 51.51,92.28 52.52,93.28 57.72,93.28 58.45,94.02 58.45,96.7 58.68,96.93 60.37,96.93 60.61,96.7 60.61,94.2 59.9,93.5 U2.19
N$59
  Bottom 0.152: JP15.1 51.84,83.03 51.84,84.98 52.12,85.27 52.12,92.02 52.74,92.65 56.8,92.65 56.9,92.65 57.95,92.65 58.3,92.3 U2.15
N$60